# EasyEDA schematic SCH_led-chaser_2025-03-19.json
TITLE: Sheet_1; REV: 1.0; Date: 2025-03-11; Sheet: 1/1; Drawn By: larrypir2; Company: Your Company
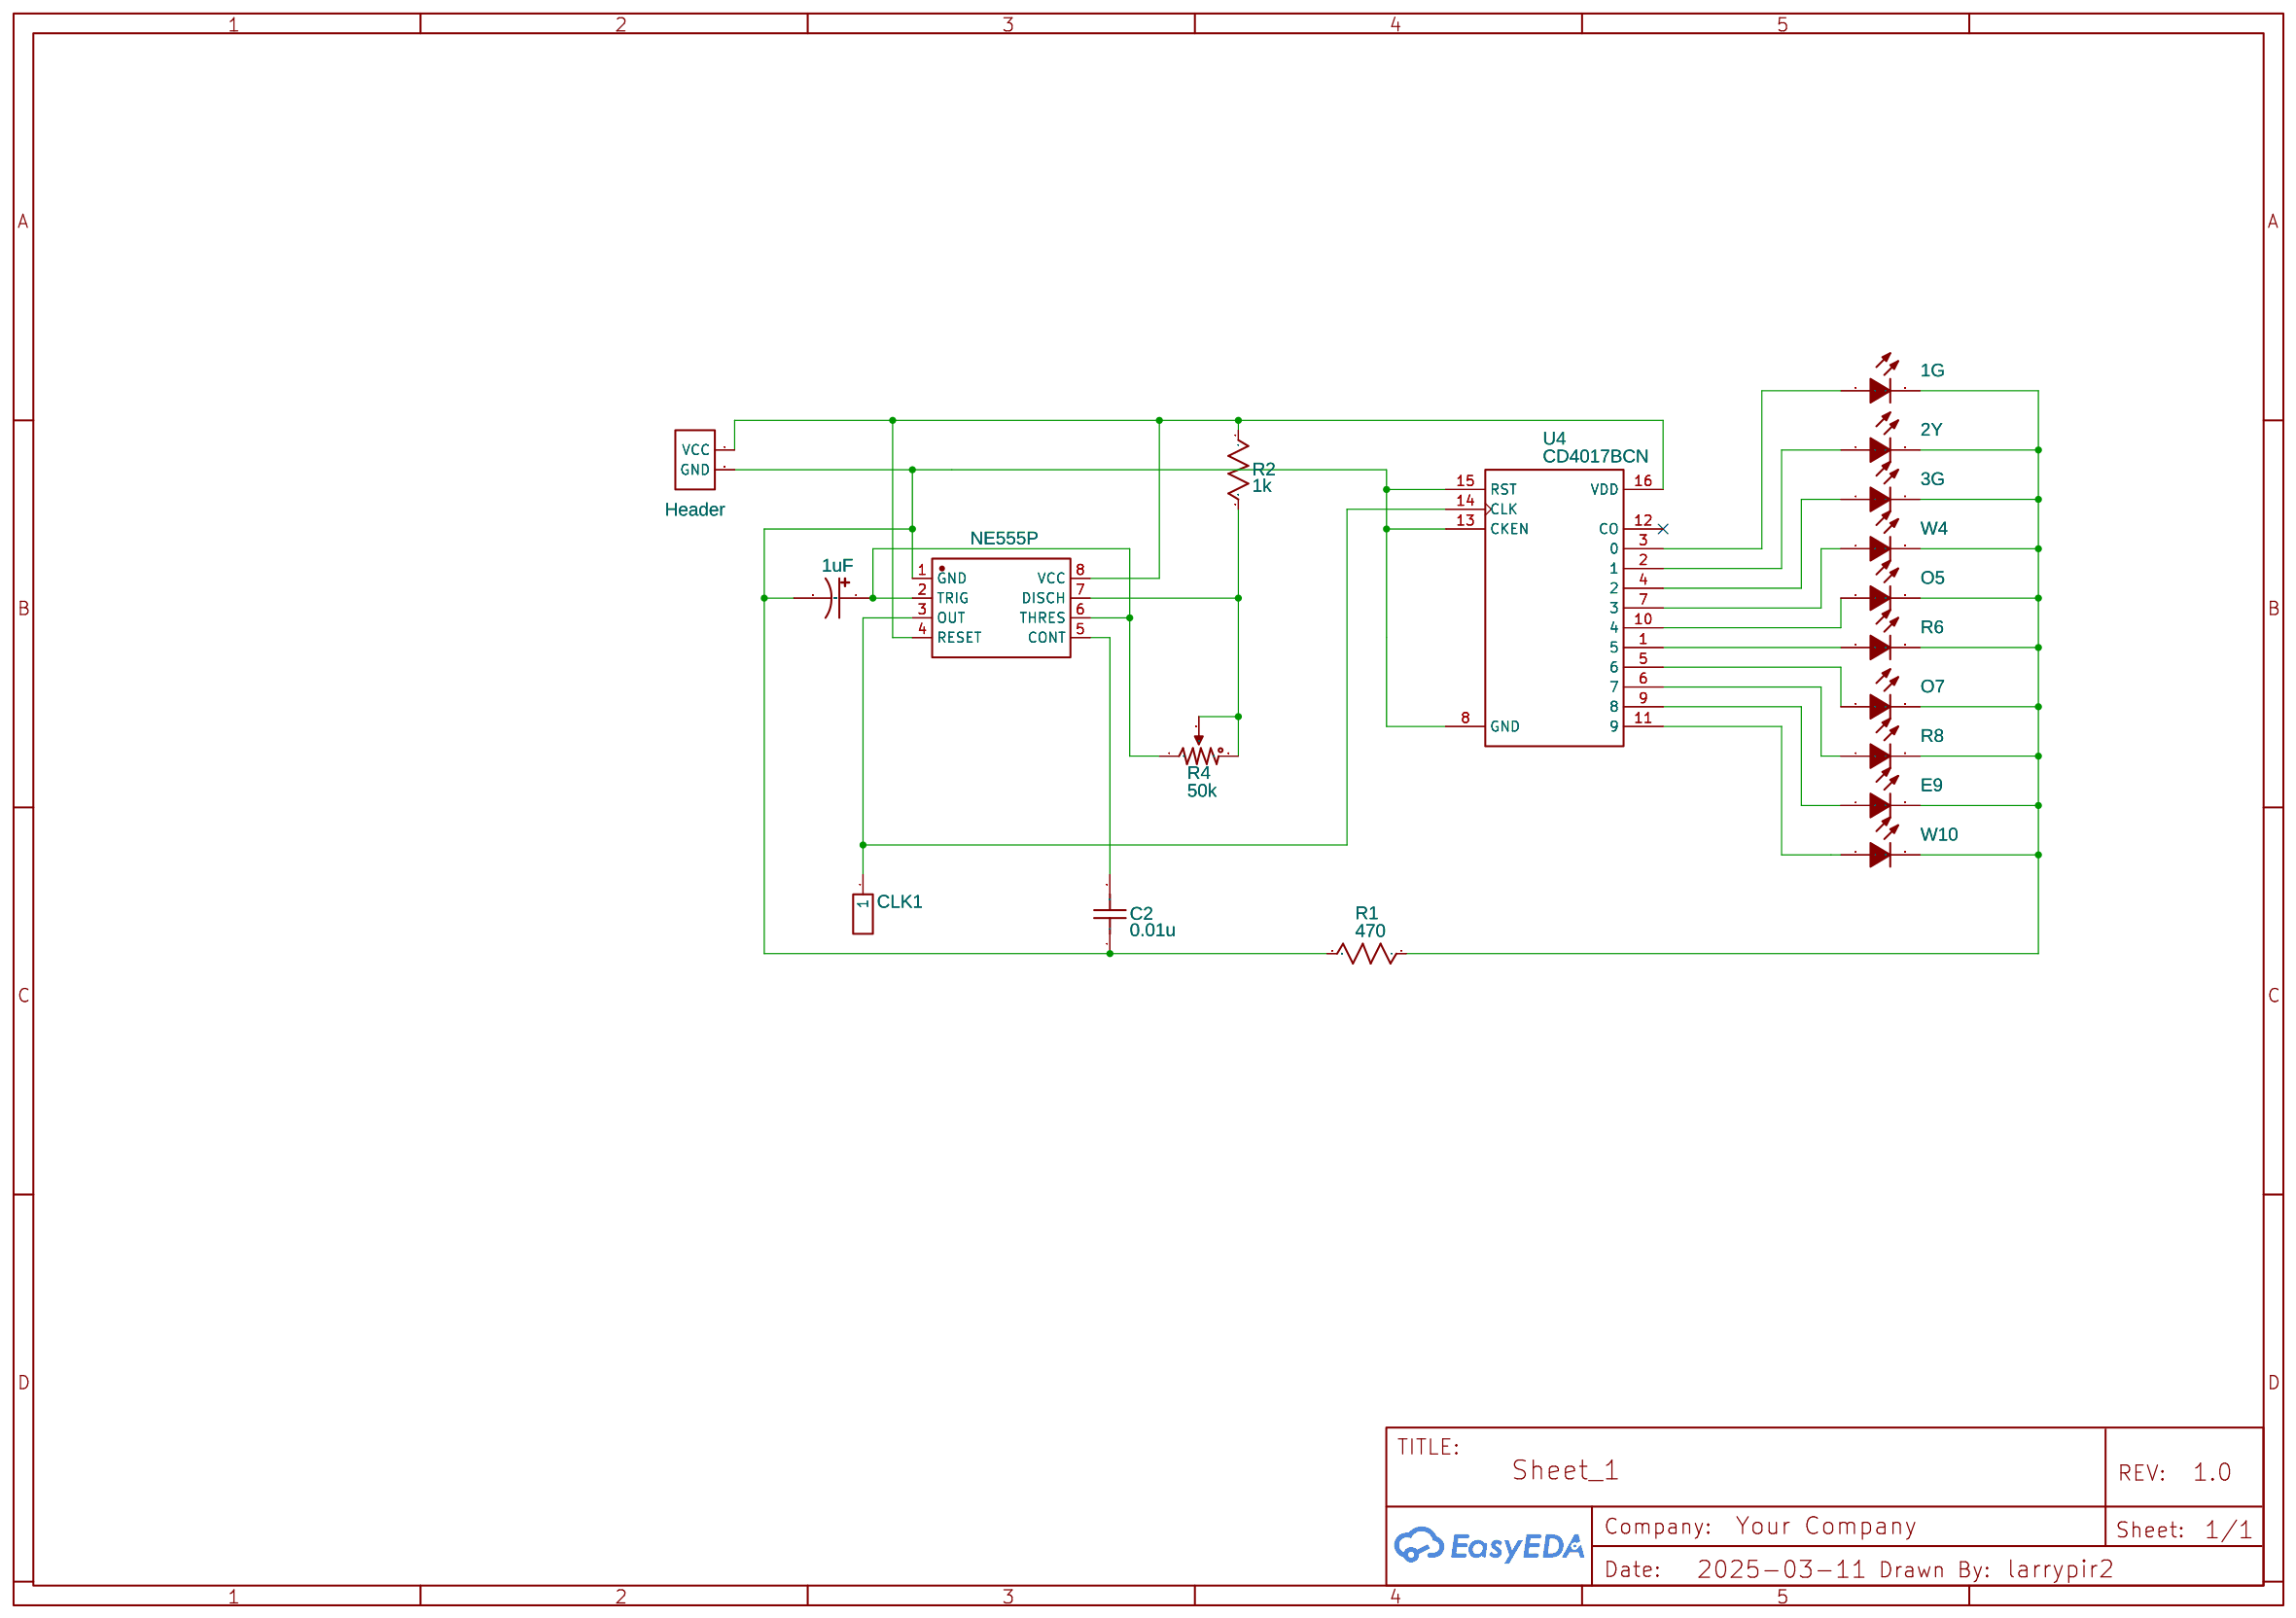
[diagram p0: schematic sheet]

## Parts
1G  LED_5MM  [LED-TH_BD5.0-P2.54-FD_C9900023552]
2Y  LED_5MM  [LED-TH_BD5.0-P2.54-FD_C9900023552]
3G  LED_5MM  [LED-TH_BD5.0-P2.54-FD_C9900023552]
C1  1uF  [CAP-TH_BD5.0-P2.00-D0.8-FD]
C2  0.01u  [C0603]
CLK1  C81276  [HDR-TH_1P-P2.54-V-M]
E9  LED_5MM  [LED-TH_BD5.0-P2.54-FD_C9900023552]
H1  Header  [HDR-M-2.54_1X2]
O5  LED_5MM  [LED-TH_BD5.0-P2.54-FD_C9900023552]
O7  LED_5MM  [LED-TH_BD5.0-P2.54-FD_C9900023552]
R1  470  [R_AXIAL-0.3]
R2  1k  [R_AXIAL-0.3]
R4  50k  [RES-ADJ-3296X]
R6  LED_5MM  [LED-TH_BD5.0-P2.54-FD_C9900023552]
R8  LED_5MM  [LED-TH_BD5.0-P2.54-FD_C9900023552]
U2  NE555P  [DIP-8_L9.8-W6.6-P2.54-LS7.6-BL]
U4  CD4017BCN  [DIP-16_L22.3-W9.1-P2.54-LS12.3-BL]
W4  LED_5MM  [LED-TH_BD5.0-P2.54-FD_C9900023552]
W10  LED_5MM  [LED-TH_BD5.0-P2.54-FD_C9900023552]

## Library data of the parts
1G 3G E9 = LED_5MM: Contributor: lcsc; Supplier: LCSC; Supplier Part: C2895483
2Y = LED_5MM: Contributor: lcsc; Supplier: LCSC; Supplier Part: C330770
C1 = UVZ1H010MDD: Contributor: LCSC; Supplier: LCSC; Supplier Part: C62934; Manufacturer: Nichicon(尼吉康)
C2 = C_0603_US: Supplier Part: C6204607; Supplier: LCSC; Contributor: LCEDA_Lib
CLK1 = Header-Male-2.54_1x1: Supplier: LCSC; Manufacturer Part: 2.54-1*1P针; JLCPCB Part Class: Extended Part; Package Display: No; Manufacturer: BOOMELE(Boom Precision Elec); Contributor: Thejo Prakash
H1 = HEADER-FEMALE-2.54_1X2: Contributor: nonstop2004; Supplier: LCSC; Supplier Part: C492401; Package Display: No
O5 O7 = LED_5MM: Contributor: lcsc; Supplier: LCSC; Supplier Part: C779445
R1 = Resistor: Manufacturer Part: ?; Supplier Part: C58592; Supplier: LCSC
R2 = Resistor: Manufacturer Part: ?; Supplier Part: C713997; Supplier: LCSC
R4 = Potentiometer: K(%): 50; Manufacturer Part: ?; Supplier: LCSC; Supplier Part: C118912; Package Display: No
R6 R8 = LED_5MM: Contributor: lcsc; Supplier: LCSC; Supplier Part: C2844743
U2 = NE555P: Supplier: LCSC; Manufacturer: TI(德州仪器); Supplier Part: C46749; JLCPCB Part Class: Extended Part
U4 = CD4017BCN: Decade CounterDivider with 10 Decoded Outputs; Supplier: LCSC; Supplier Part: C32710674; Package Display: No
W4 W10 = LED_5MM: Contributor: lcsc; Supplier: LCSC; Supplier Part: C2895480

## Nets
Net-(1G-1): 1G.1(A) U4.3(0)
Net-(1G-2): 1G.2(K) 2Y.2(K) 3G.2(K) E9.2(K) O5.2(K) O7.2(K) R1.1 R6.2(K) R8.2(K) W4.2(K) W10.2(K)
Net-(2Y-1): 2Y.1(A) U4.2(1)
Net-(3G-1): 3G.1(A) U4.4(2)
Net-(C1-1): C1.1 R4.1 U2.2(TRIG) U2.6(THRES)
Net-(C1-2): C1.2 C2.1 H1.2(GND) R1.2 U2.1(GND) U4.8(GND) U4.13(CKEN) U4.15(RST)
Net-(C2-2): C2.2 U2.5(CONT)
Net-(CLK1-1): CLK1.1 U2.3(OUT) U4.14(CLK)
Net-(E9-1): E9.1(A) U4.9(8)
Net-(H1-1): H1.1(VCC) R2.1 U2.4(RESET) U2.8(VCC) U4.16(VDD)
Net-(O5-1): O5.1(A) U4.10(4)
Net-(O7-1): O7.1(A) U4.5(6)
Net-(R2-2): R2.2 R4.2(3) R4.3(2) U2.7(DISCH)
Net-(R6-1): R6.1(A) U4.1(5)
Net-(R8-1): R8.1(A) U4.6(7)
Net-(U4-7): U4.7(3) W4.1(A)
Net-(U4-11): U4.11(9) W10.1(A)

Not connected (* = marked no-connect by the designer): U4 12(CO)*
